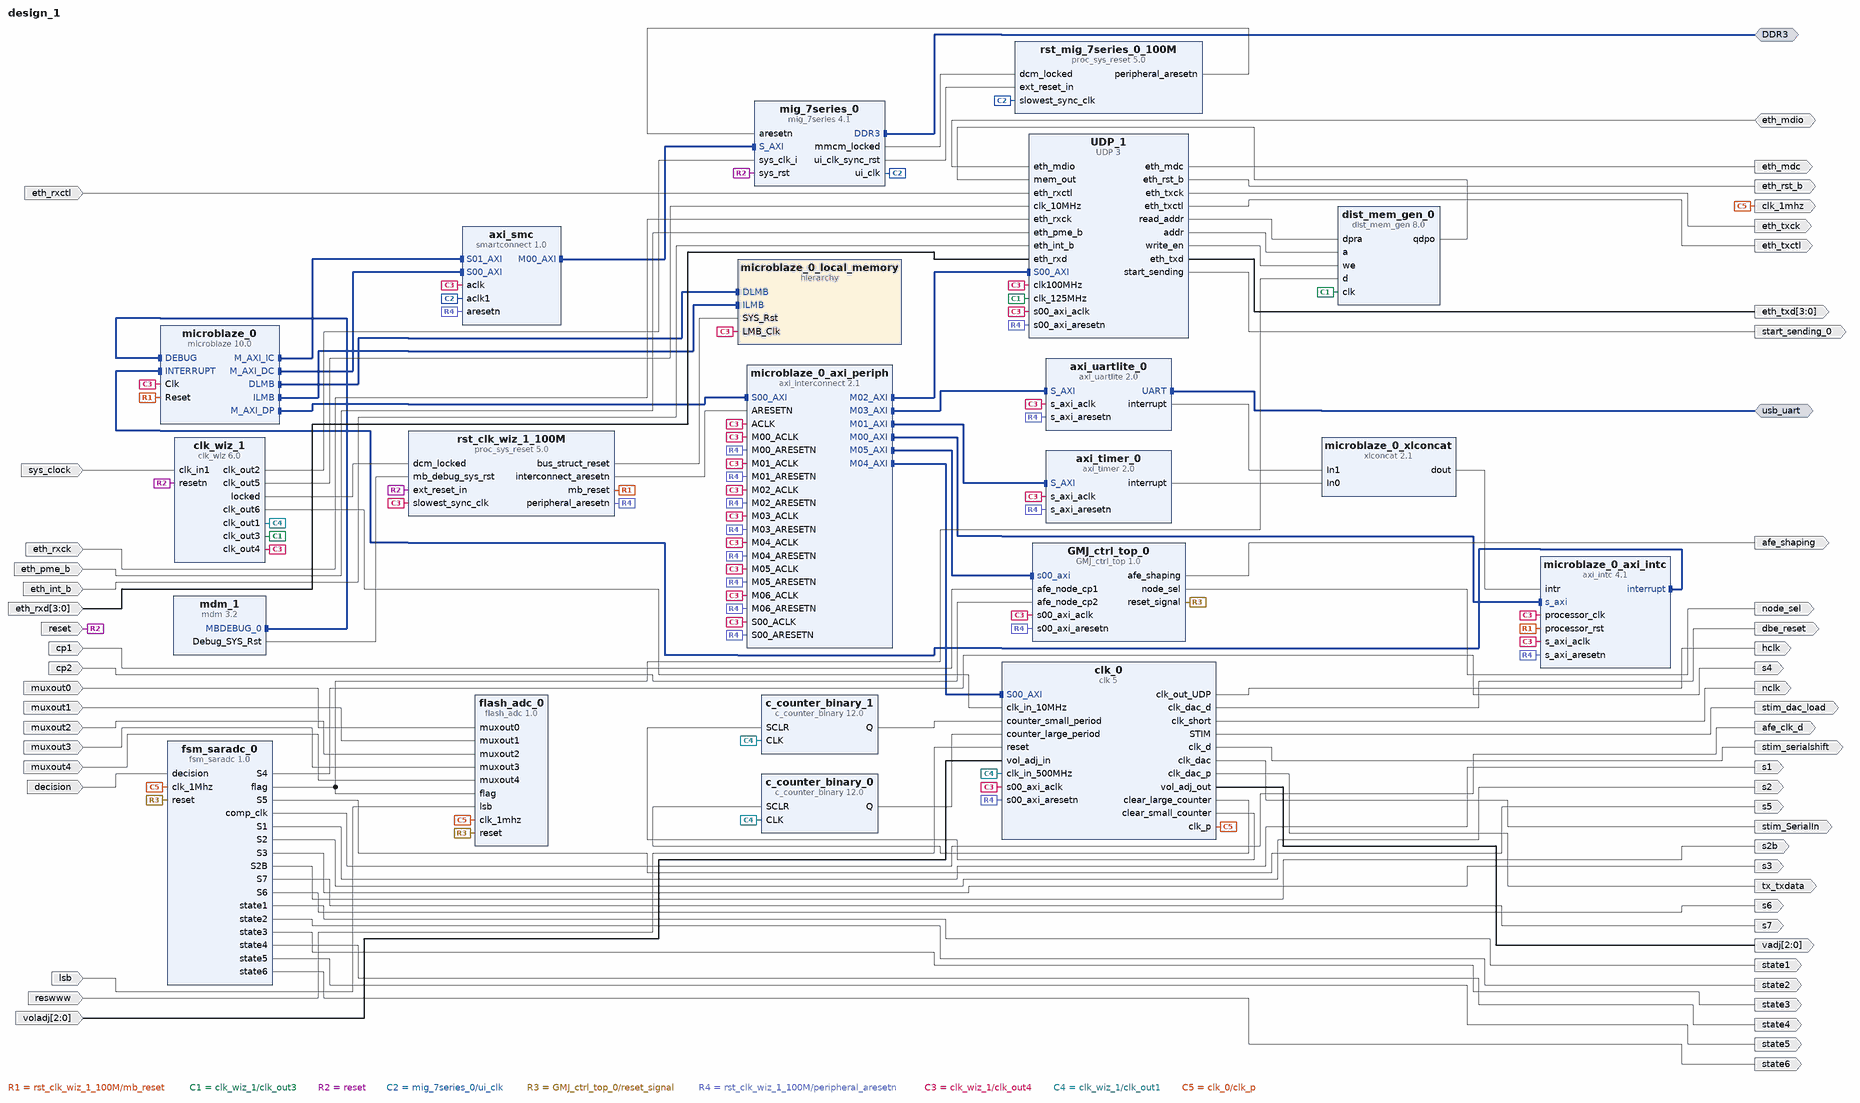
[diagram p0: block diagram of the top level]
# Vivado block design design_1, xc7a200tsbg484-1, Vivado 2018.1
create_bd_design design_1

create_bd_intf_port -mode Master -vlnv xilinx.com:interface:uart_rtl:1.0 usb_uart
create_bd_intf_port -mode Master -vlnv xilinx.com:interface:ddrx_rtl:1.0 DDR3
create_bd_port -dir I -type rst reset
set_property -dict {CONFIG.POLARITY ACTIVE_LOW} [get_bd_ports reset]
create_bd_port -dir I -type clk sys_clock
set_property -dict {CONFIG.FREQ_HZ 100000000 CONFIG.PHASE 0.000} [get_bd_ports sys_clock]
create_bd_port -dir O eth_rst_b
create_bd_port -dir O eth_mdc
create_bd_port -dir IO eth_mdio
create_bd_port -dir O eth_txck
create_bd_port -dir O eth_txctl
create_bd_port -dir O -from 3 -to 0 eth_txd
create_bd_port -dir I eth_rxctl
create_bd_port -dir I eth_rxck
create_bd_port -dir I eth_pme_b
create_bd_port -dir I eth_int_b
create_bd_port -dir I -from 3 -to 0 eth_rxd
create_bd_port -dir O start_sending_0
create_bd_port -dir I cp1
create_bd_port -dir I cp2
create_bd_port -dir O s4
create_bd_port -dir O s5
create_bd_port -dir I decision
create_bd_port -dir O afe_clk_d
create_bd_port -dir O s1
create_bd_port -dir O s2
create_bd_port -dir O s3
create_bd_port -dir O s2b
create_bd_port -dir O s7
create_bd_port -dir O s6
create_bd_port -dir O state1
create_bd_port -dir O state2
create_bd_port -dir O state3
create_bd_port -dir O state4
create_bd_port -dir O state5
create_bd_port -dir O state6
create_bd_port -dir O clk_1mhz
create_bd_port -dir O afe_shaping
create_bd_port -dir O node_sel
create_bd_port -dir I -type rst reswww
set_property -dict {CONFIG.POLARITY ACTIVE_LOW} [get_bd_ports reswww]
create_bd_port -dir I -from 2 -to 0 voladj
create_bd_port -dir O hclk
create_bd_port -dir O nclk
create_bd_port -dir O stim_serialshift
create_bd_port -dir O stim_dac_load
create_bd_port -dir O stim_SerialIn
create_bd_port -dir O -from 2 -to 0 vadj
create_bd_port -dir O dbe_reset
create_bd_port -dir O tx_txdata
create_bd_port -dir I muxout0
create_bd_port -dir I muxout1
create_bd_port -dir I muxout2
create_bd_port -dir I muxout3
create_bd_port -dir I muxout4
create_bd_port -dir I lsb

create_bd_cell -type hier microblaze_0_local_memory
create_bd_cell -type ip -vlnv xilinx.com:ip:xlconcat:2.1 microblaze_0_xlconcat
set_property -dict {CONFIG.NUM_PORTS 2} [get_bd_cells microblaze_0_xlconcat]
create_bd_cell -type ip -vlnv xilinx.com:ip:axi_intc:4.1 microblaze_0_axi_intc
set_property -dict {CONFIG.C_HAS_FAST 1} [get_bd_cells microblaze_0_axi_intc]
create_bd_cell -type ip -vlnv xilinx.com:ip:proc_sys_reset:5.0 rst_clk_wiz_1_100M
set_property -dict [list \
  CONFIG.C_EXT_RESET_HIGH 0 \
  CONFIG.USE_BOARD_FLOW true \
  CONFIG.RESET_BOARD_INTERFACE reset \
] [get_bd_cells rst_clk_wiz_1_100M]
create_bd_cell -type ip -vlnv xilinx.com:ip:dist_mem_gen:8.0 dist_mem_gen_0
set_property -dict [list \
  CONFIG.depth 2048 \
  CONFIG.data_width 8 \
  CONFIG.memory_type dual_port_ram \
  CONFIG.input_options registered \
  CONFIG.input_clock_enable false \
  CONFIG.qualify_we_with_i_ce false \
  CONFIG.dual_port_address registered \
  CONFIG.simple_dual_port_address non_registered \
  CONFIG.output_options registered \
  CONFIG.Pipeline_Stages 1 \
  CONFIG.common_output_clk true \
  CONFIG.dual_port_output_clock_enable false \
] [get_bd_cells dist_mem_gen_0]
create_bd_cell -type ip -vlnv xilinx.com:ip:axi_timer:2.0 axi_timer_0
create_bd_cell -type ip -vlnv xilinx.com:ip:axi_uartlite:2.0 axi_uartlite_0
set_property -dict {CONFIG.USE_BOARD_FLOW true CONFIG.UARTLITE_BOARD_INTERFACE usb_uart} [get_bd_cells axi_uartlite_0]
create_bd_cell -type ip -vlnv xilinx.com:ip:c_counter_binary:12.0 c_counter_binary_0
set_property -dict {CONFIG.Implementation DSP48 CONFIG.Output_Width 32 CONFIG.SCLR true} [get_bd_cells c_counter_binary_0]
create_bd_cell -type ip -vlnv xilinx.com:ip:c_counter_binary:12.0 c_counter_binary_1
set_property -dict {CONFIG.Implementation DSP48 CONFIG.Output_Width 32 CONFIG.SCLR true} [get_bd_cells c_counter_binary_1]
create_bd_cell -type ip -vlnv xilinx.com:ip:clk_wiz:6.0 clk_wiz_1
set_property -dict [list \
  CONFIG.CLKOUT2_USED true \
  CONFIG.CLKOUT3_USED true \
  CONFIG.CLKOUT4_USED true \
  CONFIG.CLKOUT5_USED true \
  CONFIG.CLKOUT6_USED true \
  CONFIG.NUM_OUT_CLKS 6 \
  CONFIG.CLKOUT1_REQUESTED_OUT_FREQ 400.000 \
  CONFIG.CLKOUT2_REQUESTED_OUT_FREQ 200.000 \
  CONFIG.CLKOUT3_REQUESTED_OUT_FREQ 125.000 \
  CONFIG.CLKOUT4_REQUESTED_OUT_FREQ 100.000 \
  CONFIG.CLKOUT5_REQUESTED_OUT_FREQ 100.000 \
  CONFIG.CLKOUT6_REQUESTED_OUT_FREQ 100.000 \
  CONFIG.PRIM_SOURCE Single_ended_clock_capable_pin \
  CONFIG.RESET_PORT resetn \
  CONFIG.MMCM_DIVCLK_DIVIDE 1 \
  CONFIG.MMCM_CLKFBOUT_MULT_F 10.000 \
  CONFIG.MMCM_CLKIN1_PERIOD 10.000 \
  CONFIG.MMCM_CLKIN2_PERIOD 10.000 \
  CONFIG.MMCM_CLKOUT0_DIVIDE_F 2.500 \
  CONFIG.MMCM_CLKOUT1_DIVIDE 5 \
  CONFIG.MMCM_CLKOUT2_DIVIDE 8 \
  CONFIG.MMCM_CLKOUT3_DIVIDE 10 \
  CONFIG.MMCM_CLKOUT4_DIVIDE 10 \
  CONFIG.MMCM_CLKOUT5_DIVIDE 10 \
  CONFIG.RESET_TYPE ACTIVE_LOW \
  CONFIG.USE_BOARD_FLOW true \
  CONFIG.CLK_IN1_BOARD_INTERFACE sys_clock \
  CONFIG.RESET_BOARD_INTERFACE reset \
  CONFIG.CLKOUT1_JITTER 101.114 \
  CONFIG.CLKOUT1_PHASE_ERROR 98.575 \
  CONFIG.CLKOUT2_JITTER 114.829 \
  CONFIG.CLKOUT2_PHASE_ERROR 98.575 \
  CONFIG.CLKOUT3_JITTER 125.247 \
  CONFIG.CLKOUT3_PHASE_ERROR 98.575 \
  CONFIG.CLKOUT4_JITTER 130.958 \
  CONFIG.CLKOUT4_PHASE_ERROR 98.575 \
  CONFIG.CLKOUT5_JITTER 130.958 \
  CONFIG.CLKOUT5_PHASE_ERROR 98.575 \
  CONFIG.CLKOUT6_JITTER 130.958 \
  CONFIG.CLKOUT6_PHASE_ERROR 98.575 \
] [get_bd_cells clk_wiz_1]
create_bd_cell -type ip -vlnv xilinx.com:ip:mdm:3.2 mdm_1
create_bd_cell -type ip -vlnv xilinx.com:ip:microblaze:10.0 microblaze_0
set_property -dict [list \
  CONFIG.C_D_AXI 1 \
  CONFIG.C_D_LMB 1 \
  CONFIG.C_I_LMB 1 \
  CONFIG.C_DEBUG_ENABLED 1 \
  CONFIG.C_USE_ICACHE 1 \
  CONFIG.C_ADDR_TAG_BITS 14 \
  CONFIG.C_CACHE_BYTE_SIZE 32768 \
  CONFIG.C_USE_DCACHE 1 \
  CONFIG.C_DCACHE_ADDR_TAG 14 \
  CONFIG.C_DCACHE_BYTE_SIZE 32768 \
] [get_bd_cells microblaze_0]
create_bd_cell -type ip -vlnv xilinx.com:ip:axi_interconnect:2.1 microblaze_0_axi_periph
set_property -dict {CONFIG.NUM_MI 7 CONFIG.SYNCHRONIZATION_STAGES 2} [get_bd_cells microblaze_0_axi_periph]
create_bd_cell -type ip -vlnv xilinx.com:user:UDP:3 UDP_1
create_bd_cell -type ip -vlnv xilinx.com:ip:proc_sys_reset:5.0 rst_mig_7series_0_100M
create_bd_cell -type ip -vlnv xilinx.com:ip:smartconnect:1.0 axi_smc
set_property -dict {CONFIG.NUM_SI 2 CONFIG.NUM_CLKS 2} [get_bd_cells axi_smc]
create_bd_cell -type ip -vlnv xilinx.com:ip:mig_7series:4.1 mig_7series_0
set_property -dict {CONFIG.XML_INPUT_FILE board.prj CONFIG.RESET_BOARD_INTERFACE reset} [get_bd_cells mig_7series_0]
create_bd_cell -type ip -vlnv xilinx.com:user:GMJ_ctrl_top:1.0 GMJ_ctrl_top_0
create_bd_cell -type ip -vlnv xilinx.com:user:flash_adc:1.0 flash_adc_0
create_bd_cell -type ip -vlnv xilinx.com:user:fsm_saradc:1.0 fsm_saradc_0
set_property -dict {CONFIG.N 4} [get_bd_cells fsm_saradc_0]
create_bd_cell -type ip -vlnv xilinx.com:user:clk:5 clk_0

# ---- hierarchy /microblaze_0_local_memory ----
current_bd_instance /microblaze_0_local_memory
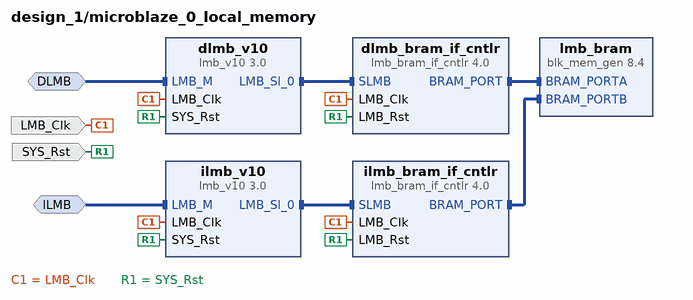
[diagram p1: block diagram inside /microblaze_0_local_memory]
create_bd_intf_pin -mode MirroredMaster -vlnv xilinx.com:interface:lmb_rtl:1.0 DLMB
create_bd_intf_pin -mode MirroredMaster -vlnv xilinx.com:interface:lmb_rtl:1.0 ILMB
create_bd_pin -dir I -type clk LMB_Clk
create_bd_pin -dir I -type rst SYS_Rst

create_bd_cell -type ip -vlnv xilinx.com:ip:lmb_v10:3.0 dlmb_v10
create_bd_cell -type ip -vlnv xilinx.com:ip:lmb_v10:3.0 ilmb_v10
create_bd_cell -type ip -vlnv xilinx.com:ip:lmb_bram_if_cntlr:4.0 dlmb_bram_if_cntlr
set_property -dict {CONFIG.C_ECC 0} [get_bd_cells dlmb_bram_if_cntlr]
create_bd_cell -type ip -vlnv xilinx.com:ip:lmb_bram_if_cntlr:4.0 ilmb_bram_if_cntlr
set_property -dict {CONFIG.C_ECC 0} [get_bd_cells ilmb_bram_if_cntlr]
create_bd_cell -type ip -vlnv xilinx.com:ip:blk_mem_gen:8.4 lmb_bram
set_property -dict [list \
  CONFIG.Memory_Type True_Dual_Port_RAM \
  CONFIG.Enable_B Use_ENB_Pin \
  CONFIG.Use_RSTB_Pin true \
  CONFIG.Port_B_Clock 100 \
  CONFIG.Port_B_Write_Rate 50 \
  CONFIG.Port_B_Enable_Rate 100 \
  CONFIG.use_bram_block BRAM_Controller \
  CONFIG.EN_SAFETY_CKT false \
] [get_bd_cells lmb_bram]

# ---- connections ----

current_bd_instance /microblaze_0_local_memory
connect_bd_intf_net -intf_net microblaze_0_dlmb_bus [get_bd_intf_pins dlmb_v10/LMB_Sl_0] [get_bd_intf_pins dlmb_bram_if_cntlr/SLMB]
connect_bd_intf_net -intf_net microblaze_0_ilmb_bus [get_bd_intf_pins ilmb_v10/LMB_Sl_0] [get_bd_intf_pins ilmb_bram_if_cntlr/SLMB]
connect_bd_intf_net -intf_net microblaze_0_dlmb_cntlr [get_bd_intf_pins dlmb_bram_if_cntlr/BRAM_PORT] [get_bd_intf_pins lmb_bram/BRAM_PORTA]
connect_bd_intf_net -intf_net microblaze_0_ilmb_cntlr [get_bd_intf_pins ilmb_bram_if_cntlr/BRAM_PORT] [get_bd_intf_pins lmb_bram/BRAM_PORTB]
connect_bd_intf_net -intf_net microblaze_0_dlmb [get_bd_intf_pins DLMB] [get_bd_intf_pins dlmb_v10/LMB_M]
connect_bd_intf_net -intf_net microblaze_0_ilmb [get_bd_intf_pins ILMB] [get_bd_intf_pins ilmb_v10/LMB_M]
connect_bd_net -net microblaze_0_Clk [get_bd_pins LMB_Clk] \
  [get_bd_pins dlmb_v10/LMB_Clk] [get_bd_pins ilmb_v10/LMB_Clk] [get_bd_pins dlmb_bram_if_cntlr/LMB_Clk] \
  [get_bd_pins ilmb_bram_if_cntlr/LMB_Clk]
connect_bd_net [get_bd_pins SYS_Rst] \
  [get_bd_pins dlmb_v10/SYS_Rst] [get_bd_pins ilmb_v10/SYS_Rst] [get_bd_pins dlmb_bram_if_cntlr/LMB_Rst] \
  [get_bd_pins ilmb_bram_if_cntlr/LMB_Rst]

current_bd_instance /
connect_bd_intf_net [get_bd_intf_pins microblaze_0/DLMB] [get_bd_intf_pins microblaze_0_local_memory/DLMB]
connect_bd_intf_net [get_bd_intf_pins microblaze_0/ILMB] [get_bd_intf_pins microblaze_0_local_memory/ILMB]
connect_bd_intf_net -intf_net microblaze_0_axi_dp [get_bd_intf_pins microblaze_0_axi_periph/S00_AXI] [get_bd_intf_pins microblaze_0/M_AXI_DP]
connect_bd_intf_net [get_bd_intf_pins microblaze_0_axi_intc/interrupt] [get_bd_intf_pins microblaze_0/INTERRUPT]
connect_bd_intf_net -intf_net microblaze_0_intc_axi [get_bd_intf_pins microblaze_0_axi_periph/M00_AXI] [get_bd_intf_pins microblaze_0_axi_intc/s_axi]
connect_bd_intf_net [get_bd_intf_pins mdm_1/MBDEBUG_0] [get_bd_intf_pins microblaze_0/DEBUG]
connect_bd_intf_net [get_bd_intf_pins microblaze_0_axi_periph/M01_AXI] [get_bd_intf_pins axi_timer_0/S_AXI]
connect_bd_intf_net [get_bd_intf_pins microblaze_0_axi_periph/M03_AXI] [get_bd_intf_pins axi_uartlite_0/S_AXI]
connect_bd_intf_net [get_bd_intf_pins microblaze_0_axi_periph/M02_AXI] [get_bd_intf_pins UDP_1/S00_AXI]
connect_bd_intf_net [get_bd_intf_pins microblaze_0/M_AXI_IC] [get_bd_intf_pins axi_smc/S01_AXI]
connect_bd_intf_net [get_bd_intf_pins microblaze_0/M_AXI_DC] [get_bd_intf_pins axi_smc/S00_AXI]
connect_bd_intf_net [get_bd_intf_pins axi_smc/M00_AXI] [get_bd_intf_pins mig_7series_0/S_AXI]
connect_bd_intf_net [get_bd_intf_pins microblaze_0_axi_periph/M05_AXI] [get_bd_intf_pins GMJ_ctrl_top_0/s00_axi]
connect_bd_intf_net [get_bd_intf_pins microblaze_0_axi_periph/M04_AXI] [get_bd_intf_pins clk_0/S00_AXI]
connect_bd_intf_net [get_bd_intf_ports usb_uart] [get_bd_intf_pins axi_uartlite_0/UART]
connect_bd_intf_net [get_bd_intf_ports DDR3] [get_bd_intf_pins mig_7series_0/DDR3]
connect_bd_net -net microblaze_0_intr [get_bd_pins microblaze_0_xlconcat/dout] [get_bd_pins microblaze_0_axi_intc/intr]
connect_bd_net [get_bd_pins clk_wiz_1/locked] [get_bd_pins rst_clk_wiz_1_100M/dcm_locked]
connect_bd_net [get_bd_pins rst_clk_wiz_1_100M/mb_reset] [get_bd_pins microblaze_0_axi_intc/processor_rst] [get_bd_pins microblaze_0/Reset]
connect_bd_net [get_bd_pins rst_clk_wiz_1_100M/bus_struct_reset] [get_bd_pins microblaze_0_local_memory/SYS_Rst]
connect_bd_net [get_bd_pins rst_clk_wiz_1_100M/interconnect_aresetn] [get_bd_pins microblaze_0_axi_periph/ARESETN]
connect_bd_net [get_bd_pins mdm_1/Debug_SYS_Rst] [get_bd_pins rst_clk_wiz_1_100M/mb_debug_sys_rst]
connect_bd_net [get_bd_pins axi_timer_0/interrupt] [get_bd_pins microblaze_0_xlconcat/In0]
connect_bd_net [get_bd_pins clk_wiz_1/clk_out3] [get_bd_pins dist_mem_gen_0/clk] [get_bd_pins UDP_1/clk_125MHz]
connect_bd_net [get_bd_ports reset] [get_bd_pins rst_clk_wiz_1_100M/ext_reset_in] [get_bd_pins clk_wiz_1/resetn] [get_bd_pins mig_7series_0/sys_rst]
connect_bd_net [get_bd_ports sys_clock] [get_bd_pins clk_wiz_1/clk_in1]
connect_bd_net [get_bd_pins UDP_1/eth_rst_b] [get_bd_ports eth_rst_b]
connect_bd_net [get_bd_pins UDP_1/eth_mdc] [get_bd_ports eth_mdc]
connect_bd_net [get_bd_ports eth_mdio] [get_bd_pins UDP_1/eth_mdio]
connect_bd_net [get_bd_pins UDP_1/eth_txck] [get_bd_ports eth_txck]
connect_bd_net [get_bd_pins UDP_1/eth_txctl] [get_bd_ports eth_txctl]
connect_bd_net [get_bd_pins UDP_1/eth_txd] [get_bd_ports eth_txd]
connect_bd_net [get_bd_pins UDP_1/read_addr] [get_bd_pins dist_mem_gen_0/dpra]
connect_bd_net [get_bd_ports eth_rxctl] [get_bd_pins UDP_1/eth_rxctl]
connect_bd_net [get_bd_ports eth_rxck] [get_bd_pins UDP_1/eth_rxck]
connect_bd_net [get_bd_ports eth_pme_b] [get_bd_pins UDP_1/eth_pme_b]
connect_bd_net [get_bd_ports eth_int_b] [get_bd_pins UDP_1/eth_int_b]
connect_bd_net [get_bd_ports eth_rxd] [get_bd_pins UDP_1/eth_rxd]
connect_bd_net [get_bd_pins UDP_1/addr] [get_bd_pins dist_mem_gen_0/a]
connect_bd_net [get_bd_pins axi_uartlite_0/interrupt] [get_bd_pins microblaze_0_xlconcat/In1]
connect_bd_net [get_bd_pins dist_mem_gen_0/qdpo] [get_bd_pins UDP_1/mem_out]
connect_bd_net [get_bd_pins clk_wiz_1/clk_out5] [get_bd_pins UDP_1/clk_10MHz]
connect_bd_net [get_bd_pins UDP_1/write_en] [get_bd_pins dist_mem_gen_0/we]
connect_bd_net [get_bd_pins UDP_1/start_sending] [get_bd_ports start_sending_0]
connect_bd_net [get_bd_pins mig_7series_0/ui_clk] [get_bd_pins rst_mig_7series_0_100M/slowest_sync_clk] [get_bd_pins axi_smc/aclk1]
connect_bd_net [get_bd_pins rst_mig_7series_0_100M/peripheral_aresetn] [get_bd_pins mig_7series_0/aresetn]
connect_bd_net [get_bd_pins clk_wiz_1/clk_out2] [get_bd_pins mig_7series_0/sys_clk_i]
connect_bd_net [get_bd_pins mig_7series_0/mmcm_locked] [get_bd_pins rst_mig_7series_0_100M/dcm_locked]
connect_bd_net [get_bd_pins mig_7series_0/ui_clk_sync_rst] [get_bd_pins rst_mig_7series_0_100M/ext_reset_in]
connect_bd_net -net cp1_1 [get_bd_ports cp1] [get_bd_pins GMJ_ctrl_top_0/afe_node_cp1]
connect_bd_net -net cp2_1 [get_bd_ports cp2] [get_bd_pins GMJ_ctrl_top_0/afe_node_cp2]
connect_bd_net [get_bd_pins GMJ_ctrl_top_0/reset_signal] [get_bd_pins flash_adc_0/reset] [get_bd_pins fsm_saradc_0/reset]
connect_bd_net [get_bd_pins fsm_saradc_0/S4] [get_bd_ports s4]
connect_bd_net [get_bd_pins fsm_saradc_0/S5] [get_bd_ports s5]
connect_bd_net [get_bd_ports decision] [get_bd_pins fsm_saradc_0/decision]
connect_bd_net [get_bd_pins fsm_saradc_0/comp_clk] [get_bd_ports afe_clk_d]
connect_bd_net [get_bd_pins fsm_saradc_0/S1] [get_bd_ports s1]
connect_bd_net [get_bd_pins fsm_saradc_0/S2] [get_bd_ports s2]
connect_bd_net [get_bd_pins fsm_saradc_0/S3] [get_bd_ports s3]
connect_bd_net [get_bd_pins fsm_saradc_0/S2B] [get_bd_ports s2b]
connect_bd_net [get_bd_pins fsm_saradc_0/S7] [get_bd_ports s7]
connect_bd_net [get_bd_pins fsm_saradc_0/S6] [get_bd_ports s6]
connect_bd_net [get_bd_pins fsm_saradc_0/state1] [get_bd_ports state1]
connect_bd_net [get_bd_pins fsm_saradc_0/state2] [get_bd_ports state2]
connect_bd_net [get_bd_pins fsm_saradc_0/state3] [get_bd_ports state3]
connect_bd_net [get_bd_pins fsm_saradc_0/state4] [get_bd_ports state4]
connect_bd_net [get_bd_pins fsm_saradc_0/state5] [get_bd_ports state5]
connect_bd_net [get_bd_pins fsm_saradc_0/state6] [get_bd_ports state6]
connect_bd_net [get_bd_pins GMJ_ctrl_top_0/afe_shaping] [get_bd_ports afe_shaping]
connect_bd_net [get_bd_pins GMJ_ctrl_top_0/node_sel] [get_bd_ports node_sel]
connect_bd_net [get_bd_pins rst_clk_wiz_1_100M/peripheral_aresetn] \
  [get_bd_pins microblaze_0_axi_intc/s_axi_aresetn] [get_bd_pins axi_timer_0/s_axi_aresetn] \
  [get_bd_pins axi_uartlite_0/s_axi_aresetn] [get_bd_pins UDP_1/s00_axi_aresetn] [get_bd_pins axi_smc/aresetn] \
  [get_bd_pins GMJ_ctrl_top_0/s00_axi_aresetn] [get_bd_pins microblaze_0_axi_periph/S00_ARESETN] \
  [get_bd_pins microblaze_0_axi_periph/M00_ARESETN] [get_bd_pins microblaze_0_axi_periph/M01_ARESETN] \
  [get_bd_pins microblaze_0_axi_periph/M02_ARESETN] [get_bd_pins microblaze_0_axi_periph/M03_ARESETN] \
  [get_bd_pins microblaze_0_axi_periph/M04_ARESETN] [get_bd_pins microblaze_0_axi_periph/M05_ARESETN] \
  [get_bd_pins microblaze_0_axi_periph/M06_ARESETN] [get_bd_pins clk_0/s00_axi_aresetn]
connect_bd_net -net microblaze_0_Clk [get_bd_pins clk_wiz_1/clk_out4] \
  [get_bd_pins microblaze_0_axi_intc/s_axi_aclk] [get_bd_pins microblaze_0_axi_intc/processor_clk] \
  [get_bd_pins rst_clk_wiz_1_100M/slowest_sync_clk] [get_bd_pins axi_timer_0/s_axi_aclk] \
  [get_bd_pins axi_uartlite_0/s_axi_aclk] [get_bd_pins microblaze_0/Clk] [get_bd_pins UDP_1/clk100MHz] \
  [get_bd_pins UDP_1/s00_axi_aclk] [get_bd_pins axi_smc/aclk] [get_bd_pins GMJ_ctrl_top_0/s00_axi_aclk] \
  [get_bd_pins microblaze_0_local_memory/LMB_Clk] [get_bd_pins microblaze_0_axi_periph/ACLK] \
  [get_bd_pins microblaze_0_axi_periph/S00_ACLK] [get_bd_pins microblaze_0_axi_periph/M00_ACLK] \
  [get_bd_pins microblaze_0_axi_periph/M01_ACLK] [get_bd_pins microblaze_0_axi_periph/M02_ACLK] \
  [get_bd_pins microblaze_0_axi_periph/M03_ACLK] [get_bd_pins microblaze_0_axi_periph/M04_ACLK] \
  [get_bd_pins microblaze_0_axi_periph/M05_ACLK] [get_bd_pins microblaze_0_axi_periph/M06_ACLK] \
  [get_bd_pins clk_0/s00_axi_aclk]
connect_bd_net [get_bd_pins clk_wiz_1/clk_out1] \
  [get_bd_pins c_counter_binary_0/CLK] [get_bd_pins c_counter_binary_1/CLK] [get_bd_pins clk_0/clk_in_500MHz]
connect_bd_net [get_bd_pins fsm_saradc_0/flag] [get_bd_pins flash_adc_0/flag] [get_bd_pins dist_mem_gen_0/d]
connect_bd_net -net muxout0_1 [get_bd_ports muxout0] [get_bd_pins flash_adc_0/muxout0]
connect_bd_net -net muxout1_1 [get_bd_ports muxout1] [get_bd_pins flash_adc_0/muxout1]
connect_bd_net -net muxout2_1 [get_bd_ports muxout2] [get_bd_pins flash_adc_0/muxout2]
connect_bd_net -net muxout3_1 [get_bd_ports muxout3] [get_bd_pins flash_adc_0/muxout3]
connect_bd_net -net muxout4_1 [get_bd_ports muxout4] [get_bd_pins flash_adc_0/muxout4]
connect_bd_net [get_bd_ports lsb] [get_bd_pins flash_adc_0/lsb]
connect_bd_net [get_bd_pins clk_0/clk_p] [get_bd_pins fsm_saradc_0/clk_1Mhz] [get_bd_pins flash_adc_0/clk_1mhz] [get_bd_ports clk_1mhz]
connect_bd_net [get_bd_pins clk_0/clear_small_counter] [get_bd_pins c_counter_binary_1/SCLR]
connect_bd_net [get_bd_pins clk_0/clear_large_counter] [get_bd_pins c_counter_binary_0/SCLR]
connect_bd_net [get_bd_pins clk_wiz_1/clk_out6] [get_bd_pins clk_0/clk_in_10MHz]
connect_bd_net [get_bd_ports reswww] [get_bd_pins clk_0/reset]
connect_bd_net [get_bd_pins c_counter_binary_1/Q] [get_bd_pins clk_0/counter_small_period]
connect_bd_net [get_bd_pins c_counter_binary_0/Q] [get_bd_pins clk_0/counter_large_period]
connect_bd_net [get_bd_ports voladj] [get_bd_pins clk_0/vol_adj_in]
connect_bd_net [get_bd_pins clk_0/STIM] [get_bd_ports stim_dac_load]
connect_bd_net [get_bd_pins clk_0/clk_out_UDP] [get_bd_ports hclk]
connect_bd_net [get_bd_pins clk_0/clk_short] [get_bd_ports nclk]
connect_bd_net [get_bd_pins clk_0/clk_d] [get_bd_ports stim_serialshift]
connect_bd_net [get_bd_pins clk_0/clk_dac] [get_bd_ports stim_SerialIn]
connect_bd_net [get_bd_pins clk_0/clk_dac_p] [get_bd_ports tx_txdata]
connect_bd_net [get_bd_pins clk_0/clk_dac_d] [get_bd_ports dbe_reset]
connect_bd_net [get_bd_pins clk_0/vol_adj_out] [get_bd_ports vadj]

# ---- address map ----
assign_bd_address -offset 0x00000000 -range 128K -target_address_space [get_bd_addr_spaces microblaze_0/Data] [get_bd_addr_segs microblaze_0_local_memory/dlmb_bram_if_cntlr/SLMB/Mem]
assign_bd_address -offset 0x40600000 -range 64K -target_address_space [get_bd_addr_spaces microblaze_0/Data] [get_bd_addr_segs axi_uartlite_0/S_AXI/Reg]
assign_bd_address -offset 0x41200000 -range 64K -target_address_space [get_bd_addr_spaces microblaze_0/Data] [get_bd_addr_segs microblaze_0_axi_intc/S_AXI/Reg]
assign_bd_address -offset 0x41C00000 -range 64K -target_address_space [get_bd_addr_spaces microblaze_0/Data] [get_bd_addr_segs axi_timer_0/S_AXI/Reg]
assign_bd_address -offset 0x44A00000 -range 64K -target_address_space [get_bd_addr_spaces microblaze_0/Data] [get_bd_addr_segs UDP_1/S00_AXI/S00_AXI_reg]
assign_bd_address -offset 0x44A10000 -range 64K -target_address_space [get_bd_addr_spaces microblaze_0/Data] [get_bd_addr_segs GMJ_ctrl_top_0/s00_axi/reg0]
assign_bd_address -offset 0x44A20000 -range 64K -target_address_space [get_bd_addr_spaces microblaze_0/Data] [get_bd_addr_segs clk_0/S00_AXI/S00_AXI_reg]
assign_bd_address -offset 0x80000000 -range 512M -target_address_space [get_bd_addr_spaces microblaze_0/Data] [get_bd_addr_segs mig_7series_0/memmap/memaddr]
assign_bd_address -offset 0x00000000 -range 128K -target_address_space [get_bd_addr_spaces microblaze_0/Instruction] [get_bd_addr_segs microblaze_0_local_memory/ilmb_bram_if_cntlr/SLMB/Mem]
assign_bd_address -offset 0x80000000 -range 512M -target_address_space [get_bd_addr_spaces microblaze_0/Instruction] [get_bd_addr_segs mig_7series_0/memmap/memaddr]

validate_bd_design
save_bd_design
